# Altium schematic sheet Sheet_1_2023-08-11.schdoc
size 265 x 199 mm
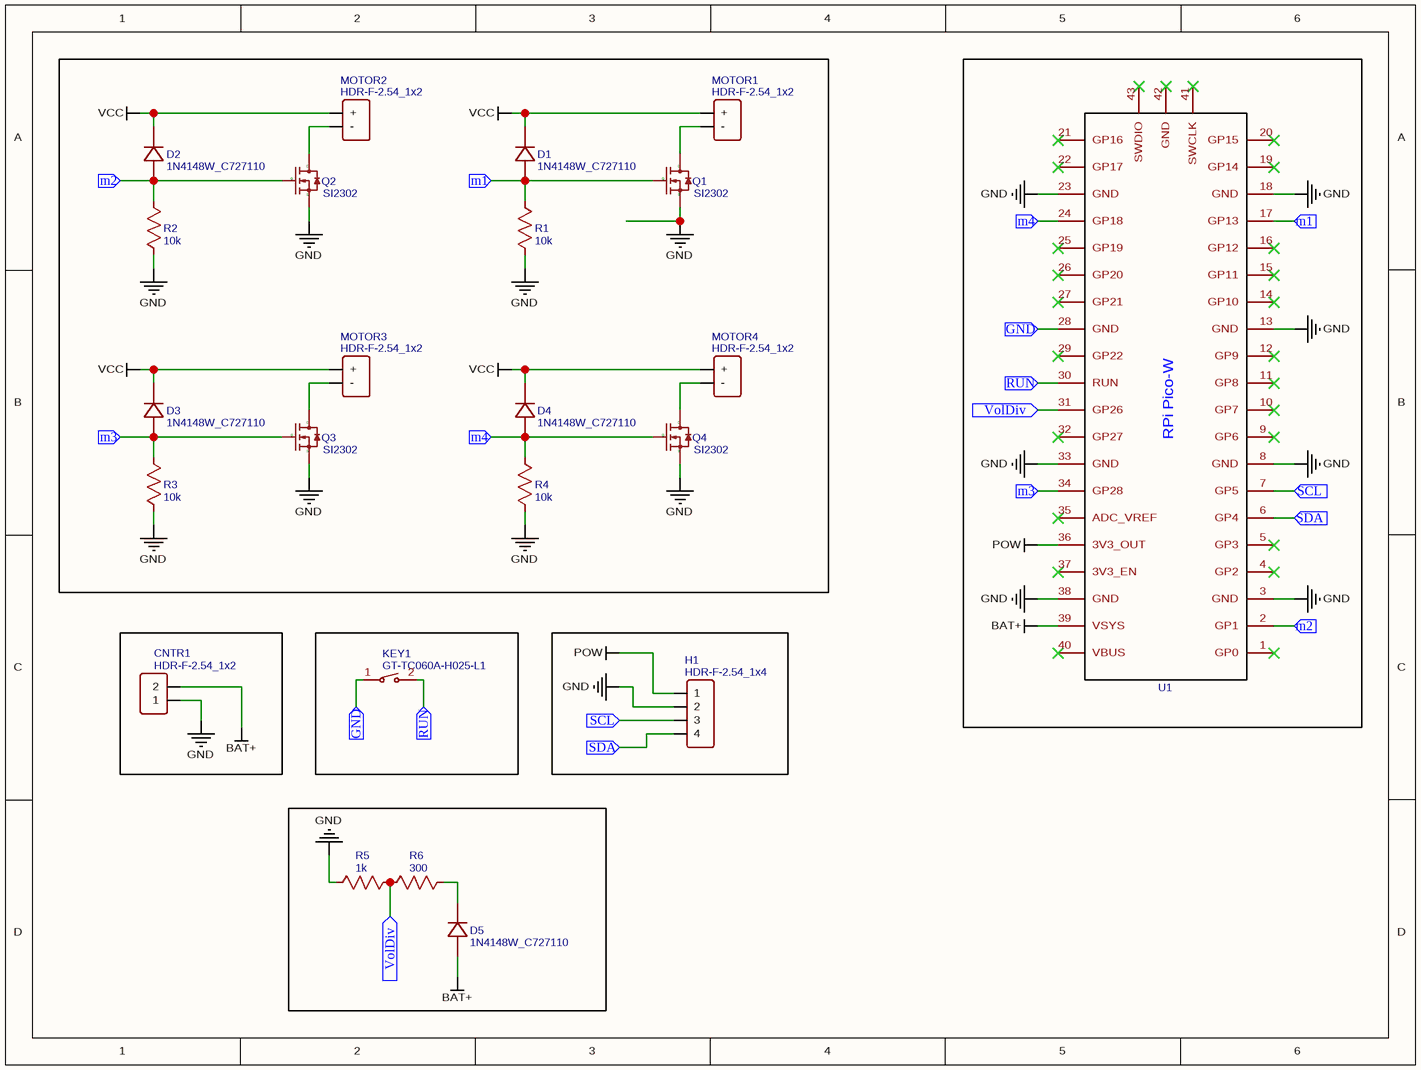
[diagram p0: Sheet_1_2023-08-11.schdoc]

## Parts
CNTR1  HDR-F-2.54_1x2  [HDR-F-2.54_1X2]
D1  1N4148W_C727110  [SOD-123_L3.1-W1.7-LS3.7-RD]
D2  1N4148W_C727110  [SOD-123_L3.1-W1.7-LS3.7-RD]
D3  1N4148W_C727110  [SOD-123_L3.1-W1.7-LS3.7-RD]
D4  1N4148W_C727110  [SOD-123_L3.1-W1.7-LS3.7-RD]
D5  1N4148W_C727110  [SOD-123_L3.1-W1.7-LS3.7-RD]
H1  HDR-F-2.54_1x4  [HDR-F-2.54_1X4]
KEY1  GT-TC060A-H025-L1  [SW-SMD_L6.1-W3.5-LS8.0]
MOTOR1  HDR-F-2.54_1x2  [HDR-F-2.54_1X2]
MOTOR2  HDR-F-2.54_1x2  [HDR-F-2.54_1X2]
MOTOR3  HDR-F-2.54_1x2  [HDR-F-2.54_1X2]
MOTOR4  HDR-F-2.54_1x2  [HDR-F-2.54_1X2]
Q1  SI2302  [SOT-23-3_L2.9-W1.3-P1.90-LS2.4-BR]
Q2  SI2302  [SOT-23-3_L2.9-W1.3-P1.90-LS2.4-BR]
Q3  SI2302  [SOT-23-3_L2.9-W1.3-P1.90-LS2.4-BR]
Q4  SI2302  [SOT-23-3_L2.9-W1.3-P1.90-LS2.4-BR]
R1  10k  [R0603]
R2  10k  [R0603]
R3  10k  [R0603]
R4  10k  [R0603]
R5  1k  [R0603]
R6  300  [R0603]
U1  (no value)  [RPI PICO-W]

## Ports
GND (in), m1 (in), m2 (in), m3 (in), m4 (in), RUN (in), SCL (in), SDA (in), VolDiv (in)

## Nets
BAT+: CNTR1.2 D5.2(A) U1.39(VSYS)
GND: CNTR1.1 H1.2 Q1.2(S) Q2.2(S) Q3.2(S) Q4.2(S) R1.2 R2.2 R3.2 R4.2 R5.1 U1.3(GND) U1.8(GND) U1.13(GND) U1.18(GND) U1.23(GND) U1.33(GND) U1.38(GND)
POW: H1.1 U1.36(3V3_OUT)
VCC: D1.1(K) D2.1(K) D3.1(K) D4.1(K) MOTOR1.1(+) MOTOR2.1(+) MOTOR3.1(+) MOTOR4.1(+)
GND: KEY1.1 U1.28(GND) ; port GND  [a separate net that carries the same name]
m1: D1.2(A) Q1.1(G) R1.1 U1.17(GP13) ; port m1
m2: D2.2(A) Q2.1(G) R2.1 U1.2(GP1) ; port m2
m3: D3.2(A) Q3.1(G) R3.1 U1.34(GP28) ; port m3
m4: D4.2(A) Q4.1(G) R4.1 U1.24(GP18) ; port m4
RUN: KEY1.2 U1.30(RUN) ; port RUN
SCL: H1.3 U1.7(GP5) ; port SCL
SDA: H1.4 U1.6(GP4) ; port SDA
VolDiv: R5.2 R6.1 U1.31(GP26) ; port VolDiv
NetD5_1: D5.1(K) R6.2
NetMOTOR1_2: MOTOR1.2(-) Q1.3(D)
NetMOTOR2_2: MOTOR2.2(-) Q2.3(D)
NetMOTOR3_2: MOTOR3.2(-) Q3.3(D)
NetMOTOR4_2: MOTOR4.2(-) Q4.3(D)

Not connected (* = marked no-connect by the designer): U1 1(GP0)* 4(GP2)* 5(GP3)* 9(GP6)* 10(GP7)* 11(GP8)* 12(GP9)* 14(GP10)* 15(GP11)* 16(GP12)* 19(GP14)* 20(GP15)* 21(GP16)* 22(GP17)* 25(GP19)* 26(GP20)* 27(GP21)* 29(GP22)* 32(GP27)* 35(ADC_VREF)* 37(3V3_EN)* 40(VBUS)* 41(SWCLK)* 42(GND)* 43(SWDIO)*

## Library data of the parts
CNTR1 MOTOR1-MOTOR4 = HDR-F-2.54_1x2: Contributor: LCEDA_Lib; Supplier Part: C49661; Supplier: LCSC; spicePre: H; spiceSymbolName: HDR-F-2.54_1x2
D1-D5 = 1N4148W_C727110: Manufacturer: TWGMC(台湾迪嘉); Contributor: LCSC; Supplier: LCSC; Supplier Part: C727110; Manufacturer Part: 1N4148W; JLCPCB Part Class: Extended Part; link: https://lcsc.com/eda_search?q=C727110&%26type=1&ref=editor; spicePre: D; spiceSymbolName: 1N4148W_C727110
H1 = HDR-F-2.54_1x4: Contributor: LCEDA_Lib; Supplier Part: C225501; Supplier: LCSC; spicePre: H; spiceSymbolName: HDR-F-2.54_1x4
KEY1 = GT-TC060A-H025-L1: Manufacturer: G-Switch(品赞); Contributor: lcsc; Supplier: LCSC; Supplier Part: C5117870; Manufacturer Part: GT-TC060A-H025-L1; JLCPCB Part Class: Extended Part; link: https://lcsc.com/eda_search?q=C5117870&%26type=1&ref=editor; spicePre: U; spiceSymbolName: GT-TC060A-H025-L1
Q1-Q4 = SI2302: Manufacturer: Hottech(合科泰); Contributor: LCSC; Supplier: LCSC; Manufacturer Part: SI2302; Supplier Part: C181087; JLCPCB Part Class: Extended Part; link: https://lcsc.com/eda_search?q=C181087&%26type=1&ref=editor; spicePre: Q; spiceSymbolName: SI2302
R1-R4 = 10k: nameAlias: Value(Ω); Contributor: LCEDA_Lib; spicePre: R; spiceSymbolName: R_0603_US
R5 = 1k: nameAlias: Value(Ω); Contributor: LCEDA_Lib; spicePre: R; spiceSymbolName: R_0603_US
R6 = 300: nameAlias: Value(Ω); Contributor: LCEDA_Lib; spicePre: R; spiceSymbolName: R_0603_US
U1 = (no symbol name): Manufacturer: Raspberry Pi Foundation; Manufacturer Part: Pi Pico; Contributor: Rovonius; Supplier: Raspberry Pi; Supplier Part: Raspberry Pi Pico-W; link: https://datasheets.raspberrypi.com/picow/pico-w-datasheet.pdf; spicePre: U; spiceSymbolName: RPi Pico-W